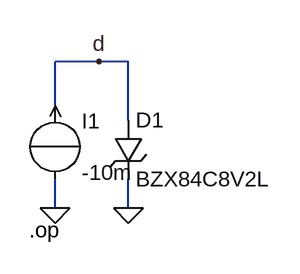
[diagram p0: schematic diode_1.asc]
diode_1.asc, the LTspice schematic file:
Version 4
SHEET 1 880 680
WIRE 160 80 112 80
WIRE 192 80 160 80
WIRE 112 128 112 80
WIRE 192 144 192 80
WIRE 112 240 112 208
WIRE 192 240 192 208
FLAG 192 240 0
FLAG 112 240 0
FLAG 160 80 d
SYMBOL zener 176 144 R0
SYMATTR InstName D1
SYMATTR Value BZX84C8V2L
SYMATTR Description Diode
SYMATTR Type diode
SYMBOL source-I 112 128 R0
SYMATTR InstName I1
SYMATTR Value -10m
TEXT 84 264 Left 2 !.op

The netlist it stands for:
* diode_1.asc
D1 d 0 BZX84C8V2L
I1 0 d -10m
.model D D
.lib standard.dio
.op
.backanno
.end